# Altium project ESCV3.PrjPcb
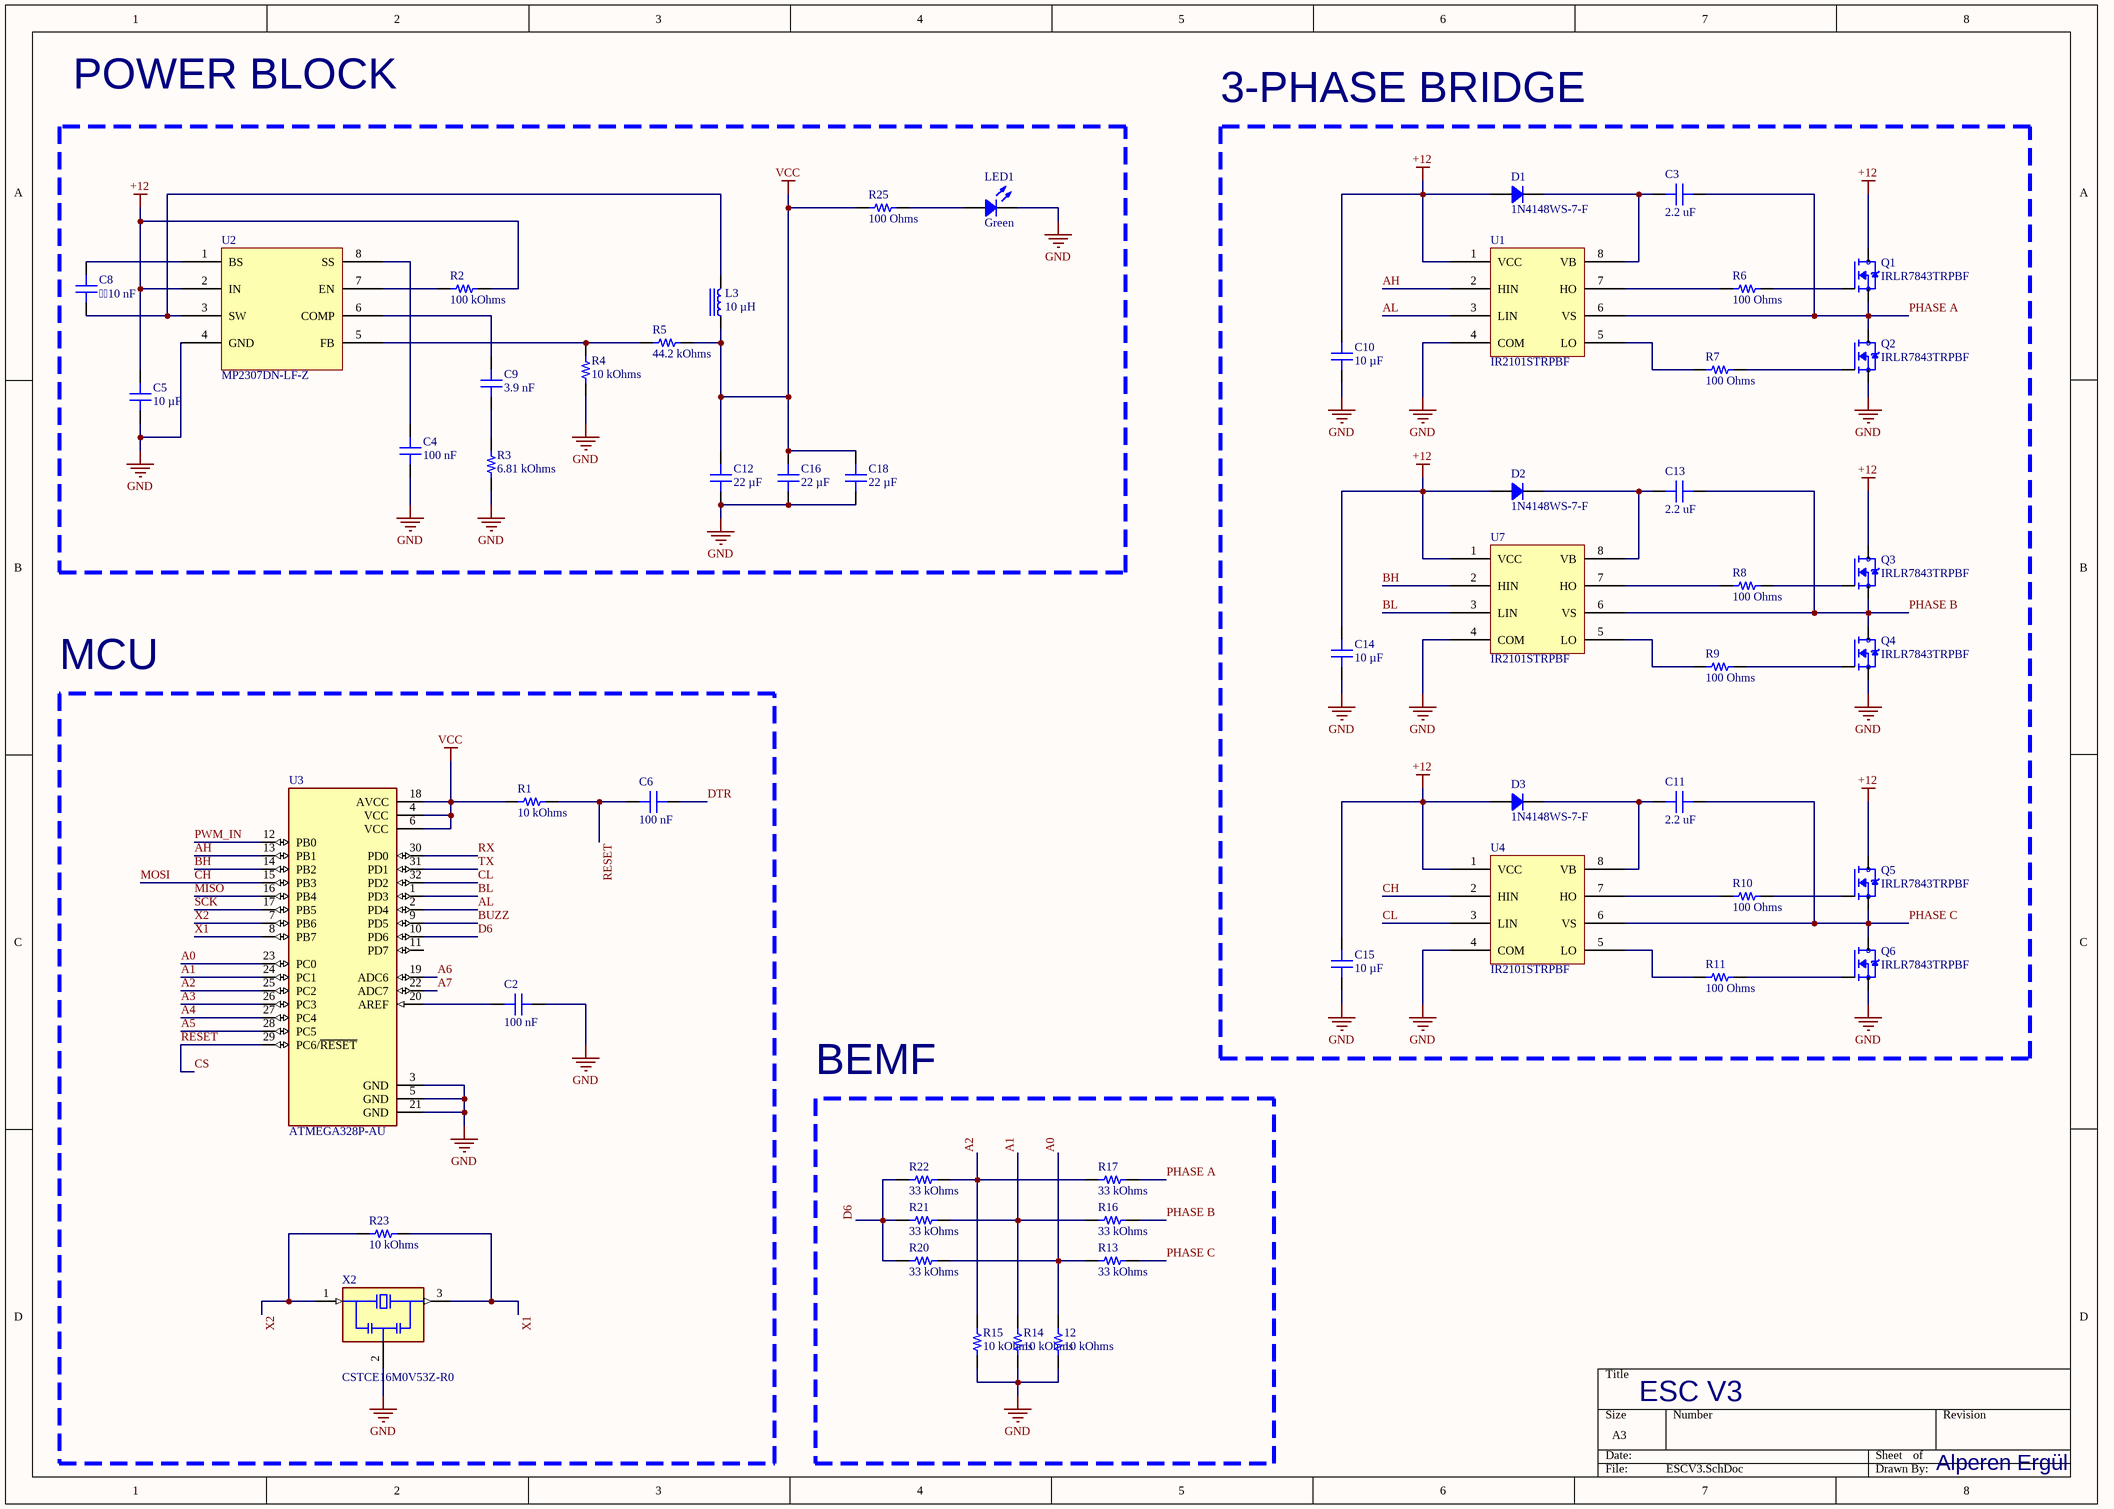
[diagram p0: ESCV3.SchDoc]
1 sheet, 54 parts. Net scope: global (net labels, ports and power ports of the same name join across sheets).
Board file: ESCV3.PcbDoc

## Sheet ESCV3.SchDoc
size A3; SheetNumber: 1; SheetTotal: 1

### Parts
12  10 kOhms  [RES 0603_1608]
C2  100 nF  [CAP 0603_1608]
C3  2.2 uF  [CAP 0603_1608]
C4  100 nF  [CAP 0603_1608]
C5  10 µF  [CAP 1206_3216 - 0.8MM]
C6  100 nF  [CAP 0603_1608]
C8  10 nF  [CAP 0603_1608]
C9  3.9 nF  [CAP 0603_1608]
C10  10 µF  [CAP 1206_3216 - 0.8MM]
C11  2.2 uF  [CAP 0603_1608]
C12  22 µF  [CAP 1206_3216 - 0.8MM]
C13  2.2 uF  [CAP 0603_1608]
C14  10 µF  [CAP 1206_3216 - 0.8MM]
C15  10 µF  [CAP 1206_3216 - 0.8MM]
C16  22 µF  [CAP 1206_3216 - 0.8MM]
C18  22 µF  [CAP 1206_3216 - 0.8MM]
D1  1N4148WS-7-F  [SOD323]
D2  1N4148WS-7-F  [SOD323]
D3  1N4148WS-7-F  [SOD323]
L3  10 µH  [BOURNS SRP5030T]
LED1  Green  [LED 0603_1608 GREEN]
Q1  IRLR7843TRPBF  [TO229P990X239-3_4N]
Q2  IRLR7843TRPBF  [TO229P990X239-3_4N]
Q3  IRLR7843TRPBF  [TO229P990X239-3_4N]
Q4  IRLR7843TRPBF  [TO229P990X239-3_4N]
Q5  IRLR7843TRPBF  [TO229P990X239-3_4N]
Q6  IRLR7843TRPBF  [TO229P990X239-3_4N]
R1  10 kOhms  [RES 0603_1608]
R2  100 kOhms  [RES 0603_1608]
R3  6.81 kOhms  [RES 0603_1608]
R4  10 kOhms  [RES 0603_1608]
R5  44.2 kOhms  [RES 0603_1608]
R6  100 Ohms  [RES 0603_1608]
R7  100 Ohms  [RES 0603_1608]
R8  100 Ohms  [RES 0603_1608]
R9  100 Ohms  [RES 0603_1608]
R10  100 Ohms  [RES 0603_1608]
R11  100 Ohms  [RES 0603_1608]
R13  33 kOhms  [RES 0603_1608]
R14  10 kOhms  [RES 0603_1608]
R15  10 kOhms  [RES 0603_1608]
R16  33 kOhms  [RES 0603_1608]
R17  33 kOhms  [RES 0603_1608]
R20  33 kOhms  [RES 0603_1608]
R21  33 kOhms  [RES 0603_1608]
R22  33 kOhms  [RES 0603_1608]
R23  10 kOhms  [RES 0603_1608]
R25  100 Ohms  [RES 0603_1608]
U1  IR2101STRPBF  [IR2101STRPBF]
U2  MP2307DN-LF-Z  [MP2307DN-LF-Z]
U3  ATMEGA328P-AU  [QFP80P900X900X120-32N]
U4  IR2101STRPBF  [IR2101STRPBF]
U7  IR2101STRPBF  [IR2101STRPBF]
X2  CSTCE16M0V53Z-R0  [OSC_CSTCE16M0V53Z-R0]

### Blocks framed on the sheet
3-PHASE BRIDGE: C3 C10 C11 C13-C15 D1-D3 Q1-Q6 R6-R11 U1 U4 U7
MCU: C2 C6 R1 R23 U3 X2
BEMF: 12 R13-R17 R20-R22

### Nets
+12: C5.2 C10.2 C14.2 C15.2 D1.1 D2.1 D3.1 Q1.4(D) Q3.4(D) Q5.4(D) R2.2 U1.1(VCC) U2.2(IN) U4.1(VCC) U7.1(VCC)
GND: 12.1 C2.2 C4.1 C5.1 C10.1 C12.1 C14.1 C15.1 C16.1 C18.1 LED1.2 Q2.3(S) Q4.3(S) Q6.3(S) R3.1 R4.1 R14.1 R15.1 U1.4(COM) U2.4(GND) U3.3(GND) U3.5(GND) U3.21(GND) U4.4(COM) U7.4(COM) X2.2(GND)
VCC: C12.2 C16.2 C18.2 L3.1 R1.1 R5.2 R25.1 U3.4(VCC) U3.6(VCC) U3.18(AVCC)
A0: 12.2 R13.1 R20.2 U3.23(PC0)
A1: R14.2 R16.1 R21.2 U3.24(PC1)
A2: R15.2 R17.1 R22.2 U3.25(PC2)
A3: U3.26(PC3)
A4: U3.27(PC4)
A5: U3.28(PC5)
A6: U3.19(ADC6)
A7: U3.22(ADC7)
AH: U1.2(HIN) U3.13(PB1)
AL: U1.3(LIN) U3.2(PD4)
BH: U3.14(PB2) U7.2(HIN)
BL: U3.1(PD3) U7.3(LIN)
BUZZ: U3.9(PD5)
CH: U3.15(PB3) U4.2(HIN)  [also labelled MOSI]
CL: U3.32(PD2) U4.3(LIN)
CS: C6.1 R1.2 U3.29(PC6/~{RESET})  [also labelled RESET]
D6: R20.1 R21.1 R22.1 U3.10(PD6)
DTR: C6.2
MISO: U3.16(PB4)
PHASE A: C3.2 Q1.3(S) Q2.4(D) R17.2 U1.6(VS)
PHASE B: C13.2 Q3.3(S) Q4.4(D) R16.2 U7.6(VS)
PHASE C: C11.2 Q5.3(S) Q6.4(D) R13.2 U4.6(VS)
PWM_IN: U3.12(PB0)
RX: U3.30(PD0)
SCK: U3.17(PB5)
TX: U3.31(PD1)
X1: R23.2 U3.8(PB7) X2.3(OUT)
X2: R23.1 U3.7(PB6) X2.1(IN)
NetC2_1: C2.1 U3.20(AREF)
NetC3_1: C3.1 D1.2 U1.8(VB)
NetC4_2: C4.2 U2.8(SS)
NetC8_1: C8.1 U2.1(BS)
NetC8_2: C8.2 L3.2 U2.3(SW)
NetC9_1: C9.1 R3.2
NetC9_2: C9.2 U2.6(COMP)
NetC11_1: C11.1 D3.2 U4.8(VB)
NetC13_1: C13.1 D2.2 U7.8(VB)
NetLED1_1: LED1.1 R25.2
NetQ1_1: Q1.1(G) R6.2
NetQ2_1: Q2.1(G) R7.2
NetQ3_1: Q3.1(G) R8.2
NetQ4_1: Q4.1(G) R9.2
NetQ5_1: Q5.1(G) R10.2
NetQ6_1: Q6.1(G) R11.2
NetR2_1: R2.1 U2.7(EN)
NetR4_2: R4.2 R5.1 U2.5(FB)
NetR6_1: R6.1 U1.7(HO)
NetR7_1: R7.1 U1.5(LO)
NetR8_1: R8.1 U7.7(HO)
NetR9_1: R9.1 U7.5(LO)
NetR10_1: R10.1 U4.7(HO)
NetR11_1: R11.1 U4.5(LO)

Not connected (* = marked no-connect by the designer): U3 11(PD7)

### Notes on the sheet
- POWER BLOCK
- ESC V3
- Alperen Ergül

### Library data of the parts
12 R1 R4 R14 R15 R23 = RNCS0603BKE10K0: RES 10K OHM 0.1% 1/16W 0603; Manufacturer: Stackpole Electronics Inc; Power (Watts): 0.063W, 1/16W; Temperature Coefficient: ±25ppm/°C; Part Number: RNCS0603BKE10K0; Value: 10 kOhms; ComponentLink1Description: Datasheet; ComponentLink1URL: https://www.seielect.com/catalog/sei-rncs_rnch.pdf; ComponentLink2Description: DigiKey Link; ComponentLink2URL: https://www.digikey.com/en/products/detail/stackpole-electronics-inc/RNCS0603BKE10K0/1708836; Composition: Thin Film; Device Package: 0603 (1608 Metric); Features: Anti-Corrosive, Automotive AEC-Q200, Moisture Resistant; Height - Seated (Max): 0.022" (0.55mm); LastUpdated: 9.02.2024 20:43:37; Lifecycle Status: Active; Minimum Order: 1; Number of Terminations: 2; Operating Temperature: -55°C ~ 155°C; Package / Case: 0603 (1608 Metric); Packaging: TapeAndReel; PartId: 4838; Part Status: Active; Price: 0.06; Ratings: AEC-Q200; Resistance: 10 kOhms; Series: RNCS; Size / Dimension: 0.061" L x 0.031" W (1.55mm x 0.80mm); Supplier 1: DigiKey; Supplier Part Number 1: RNCS0603BKE10K0CT-ND; Supplier Device Package: 0603; Tolerance: ±0.1%
C2-C4 C6 C8 C9 C11 C13 = CBR06C399BAGAC: CAP CER 3.9PF 250V C0G/NP0 0603; manufacturer: KEMET; Temperature Coefficient: C0G, NP0; Tolerance: ±0.1pF; Part Number: CBR06C399BAGAC; Applications: RF, Microwave, High Frequency; Capacitance: 3.9 pF; componentlink1description: Datasheet; componentlink1url: https://api.kemet.com/component-edge/download/datasheet/CBR06C399BAGAC.pdf; componentlink2description: DigiKey Link; componentlink2url: https://www.digikey.com/en/products/detail/kemet/CBR06C399BAGAC/3479707; Device Package: 0603 (1608 Metric); Features: High Q, Low Loss, Ultra Low ESR; lastupdated: 9.02.2024 20:10:06; Lifecycle Status: Active; Minimum Order: 1; Mounting Type: Surface Mount, MLCC; Operating Temperature: -55°C ~ 125°C; Package / Case: 0603 (1608 Metric); packaging: TapeAndReel; partid: 18061; Part Status: Active; price: 0.12; series: CBR-SMD RF C0G; Size / Dimension: 0.063" L x 0.031" W (1.60mm x 0.80mm); Supplier 1: DigiKey; Supplier Part Number 1: 399-8807-1-ND; Thickness (Max): 0.035" (0.90mm); Voltage - Rated: 250V
  C2 C4 C6: Value: 100 nF
  C3 C11 C13: Value: 2.2 uF
  C9: Value: 3.9 nF
C5 C10 C14 C15 = EMK316BJ106MD-T: CAP CER 10UF 16V X5R 1206; manufacturer: Taiyo Yuden; Tolerance: ±20%; Part Number: EMK316BJ106MD-T; Value: 10 µF; Applications: SMPS Filtering; Capacitance: 10 µF; componentlink1description: Datasheet; componentlink1url: http://www.yuden.co.jp/productdata/catalog/mlcc06_e.pdf; componentlink2description: DigiKey Link; componentlink2url: https://www.digikey.com/en/products/detail/taiyo-yuden/EMK316BJ106MD-T/6563474; Device Package: 1206 (3216 Metric); lastupdated: 4.06.2024 19:10:41; Lifecycle Status: Active; Minimum Order: 1; Mounting Type: Surface Mount, MLCC; Operating Temperature: -55°C ~ 85°C; Package / Case: 1206 (3216 Metric); packaging: TapeAndReel; partid: 18996; Part Status: Active; price: 0.04; series: M; Size / Dimension: 0.126" L x 0.063" W (3.20mm x 1.60mm); Supplier 1: DigiKey; Supplier Part Number 1: 587-4881-1-ND; Temperature Coefficient: X5R; Thickness (Max): 0.037" (0.95mm); Voltage - Rated: 16V
C12 C16 C18 = CL31A226MOCLNNC: CAP CER 22UF 16V X5R 1206; manufacturer: Samsung Electro-Mechanics; Tolerance: ±20%; Part Number: CL31A226MOCLNNC; Value: 22 µF; Applications: General Purpose; Capacitance: 22 µF; componentlink1description: Datasheet; componentlink1url: http://www.samsungsem.com/kr/support/product-search/mlcc/CL31A226MOCLNNC.jsp; componentlink2description: DigiKey Link; componentlink2url: https://www.digikey.com/en/products/detail/samsung-electro-mechanics/CL31A226MOCLNNC/3888386; Device Package: 1206 (3216 Metric); Features: Low Profile; lastupdated: 4.06.2024 19:10:40; Lifecycle Status: Active; Minimum Order: 1; Mounting Type: Surface Mount, MLCC; Operating Temperature: -55°C ~ 85°C; Package / Case: 1206 (3216 Metric); packaging: TapeAndReel; partid: 19106; Part Status: Active; price: 0.04; series: CL; Size / Dimension: 0.126" L x 0.063" W (3.20mm x 1.60mm); Supplier 1: DigiKey; Supplier Part Number 1: 1276-2728-1-ND; Temperature Coefficient: X5R; Thickness (Max): 0.037" (0.95mm); Voltage - Rated: 16V
D1-D3 = 1N4148WS-7-F: DIODE GEN PURP 75V 150MA SOD323; Manufacturer: Diodes Incorporated; Capacitance @ Vr, F: 2pF @ 0V, 1MHz; Current - Reverse Leakage @ Vr: 1 µA @ 75 V; Diode Type: Standard; Reverse Recovery Time (trr): 4 ns; Speed: Small Signal =< 200mA (Io), Any Speed; Voltage - Forward (Vf) (Max) @ If: 1.25 V @ 150 mA; Part Number: 1N4148WS-7-F; ComponentLink1Description: Datasheet; ComponentLink1URL: https://www.diodes.com/assets/Datasheets/ds30097.pdf; ComponentLink2Description: DigiKey Link; ComponentLink2URL: https://www.digikey.com/en/products/detail/diodes-incorporated/1N4148WS-7-F/815127; Current - Average Rectified (Io): 150mA; LastUpdated: 3.06.2024 20:20:13; Lifecycle Status: Active; Minimum Order: 1; Mounting Type: Surface Mount; Operating Temperature - Junction: -65°C ~ 150°C; Package / Case: SC-76, SOD-323; Packaging: TapeAndReel; PartId: 3076; Part Status: Active; Price: 0.02; Series: -; Supplier 1: DigiKey; Supplier Part Number 1: 1N4148WS-FDICT-ND; Supplier Device Package: SOD-323; Voltage - DC Reverse (Vr) (Max): 75 V
L3 = SRP5030T-100M: FIXED IND 10UH 2.75A 128MOHM SMD; Manufacturer: Bourns Inc.; Current - Saturation: 3.5A; DC Resistance (DCR): 128mOhm Max; Inductance Frequency - Test: 100 kHz; Material - Core: Iron Powder; Shielding: Shielded; Tolerance: ±20%; Type: Drum Core, Wirewound; Part Number: SRP5030T-100M; ComponentLink1Description: Datasheet; ComponentLink1URL: https://www.bourns.com/docs/Product-Datasheets/SRP5030T.pdf; ComponentLink2Description: DigiKey Link; ComponentLink2URL: https://www.digikey.com/en/products/detail/bourns-inc/SRP5030T-100M/3986087; Current Rating (Amps): 2.75 A; Device Package: Nonstandard; Height - Seated (Max): 0.118" (3.00mm); Inductance: 10 µH; LastUpdated: 3.06.2024 20:02:35; Lifecycle Status: Active; Minimum Order: 1; Mounting Type: Surface Mount; Operating Temperature: -40°C ~ 125°C; Package / Case: Nonstandard; Packaging: TapeAndReel; PartId: 9; Part Status: Active; Price: 0.59; Series: SRP5030T; Size / Dimension: 0.224" L x 0.205" W (5.70mm x 5.20mm); Supplier 1: DigiKey; Supplier Part Number 1: SRP5030T-100MCT-ND; Value: 10 µH
LED1 = LSM0603453V: LED GREEN CLEAR CHIP 0603 SMD; Manufacturer: Visual Communications Company - VCC; Configuration: Standard; Current - Test: 20mA; Lens Color: Colorless; Lens Size: 1.20mm x 0.80mm; Lens Style: Rectangle with Flat Top; Millicandela Rating: 63mcd; Viewing Angle: 120°; Voltage - Forward (Vf) (Typ): 2V; Wavelength - Dominant: 572nm; Wavelength - Peak: 571nm; Part Number: LSM0603453V; Color: Green; ComponentLink1Description: Datasheet; ComponentLink1URL: https://vcclite.com/wp-content/uploads/wpallimport/files/files/LSM0603453V.pdf; ComponentLink2Description: DigiKey Link; ComponentLink2URL: https://www.digikey.com/en/products/detail/visual-communications-company-vcc/LSM0603453V/9486724; Device Package: 0603 (1608 Metric); Height (Max): 0.65mm; LastUpdated: 3.06.2024 19:58:54; Lens Transparency: Clear; Lifecycle Status: Active; Minimum Order: 1; Mounting Type: Surface Mount; Package / Case: 0603 (1608 Metric); Packaging: TapeAndReel; PartId: 579; Part Status: Active; Price: 0.09; Series: LSM0603; Size / Dimension: 1.60mm L x 0.80mm W; Supplier 1: DigiKey; Supplier Part Number 1: LSM0603453VCT-ND; Supplier Device Package: Chip LED; Value: Green
Q1-Q6 = IRLR7843TRPBF: RoHS Compliant | Industry-leading quality | Low RDS(ON) at 4.5V VGS | Fully Characterized Avalanche Voltage and Current | Ultra-Low Gate Impedance | Logic Level; MF: Infineon Technologies; Value: *; Check_prices: https://www.snapeda.com/parts/IRLR7843TRPBF/Infineon+Technologies/view-part/?ref=eda; SnapEDA_Link: https://www.snapeda.com/parts/IRLR7843TRPBF/Infineon+Technologies/view-part/?ref=snap; Availability: In Stock; MP: IRLR7843TRPBF; Purchase-URL: https://pricing.snapeda.com/search/part/IRLR7843TRPBF/?ref=eda; Package: TO-252-3 Infineon; Price: None
R2 = RNCS0603BKE100K: RES 100K OHM 0.1% 1/16W 0603; Manufacturer: Stackpole Electronics Inc; Power (Watts): 0.063W, 1/16W; Temperature Coefficient: ±25ppm/°C; Part Number: RNCS0603BKE100K; Value: 100 kOhms; ComponentLink1Description: Datasheet; ComponentLink1URL: https://www.seielect.com/catalog/sei-rncs_rnch.pdf; ComponentLink2Description: DigiKey Link; ComponentLink2URL: https://www.digikey.com/en/products/detail/stackpole-electronics-inc/RNCS0603BKE100K/1708835; Composition: Thin Film; Device Package: 0603 (1608 Metric); Features: Anti-Corrosive, Automotive AEC-Q200, Moisture Resistant; Height - Seated (Max): 0.022" (0.55mm); LastUpdated: 9.02.2024 20:43:37; Lifecycle Status: Active; Minimum Order: 1; Number of Terminations: 2; Operating Temperature: -55°C ~ 155°C; Package / Case: 0603 (1608 Metric); Packaging: TapeAndReel; PartId: 4849; Part Status: Active; Price: 0.06; Ratings: AEC-Q200; Resistance: 100 kOhms; Series: RNCS; Size / Dimension: 0.061" L x 0.031" W (1.55mm x 0.80mm); Supplier 1: DigiKey; Supplier Part Number 1: RNCS0603BKE100KCT-ND; Supplier Device Package: 0603; Tolerance: ±0.1%
R3 = RQ73C1J6K81BTDF: RQ 0603 6K81 0.1% 10PPM 1K RL; Manufacturer: TE Connectivity Passive Product; Power (Watts): 0.15W; Temperature Coefficient: ±10ppm/°C; Part Number: RQ73C1J6K81BTDF; Value: 6.81 kOhms; ComponentLink1Description: Datasheet; ComponentLink1URL: https://www.te.com/commerce/DocumentDelivery/DDEController?Action=srchrtrv&DocNm=1773270-2&DocType=DS&DocLang=English; ComponentLink2Description: DigiKey Link; ComponentLink2URL: https://www.digikey.com/en/products/detail/te-connectivity-passive-product/RQ73C1J6K81BTDF/13965021; Composition: Thin Film; Device Package: 0603 (1608 Metric); Features: Anti-Sulfur, Automotive AEC-Q200, Moisture Resistant; Height - Seated (Max): 0.022" (0.55mm); LastUpdated: 9.02.2024 20:41:31; Lifecycle Status: Active; Minimum Order: 1; Number of Terminations: 2; Operating Temperature: -55°C ~ 155°C; Package / Case: 0603 (1608 Metric); Packaging: TapeAndReel; PartId: 63038; Part Status: Active; Price: 0.38; Ratings: AEC-Q200; Resistance: 6.81 kOhms; Series: RQ73; Size / Dimension: 0.061" L x 0.031" W (1.55mm x 0.80mm); Supplier 1: DigiKey; Supplier Part Number 1: 1712-RQ73C1J6K81BTDFCT-ND; Supplier Device Package: 0603; Tolerance: ±0.1%
R5 = ERJ-PB3B4422V: RES SMD 44.2K OHM 0.1% 1/5W 0603; Manufacturer: Panasonic Electronic Components; Power (Watts): 0.2W, 1/5W; Temperature Coefficient: ±50ppm/°C; Part Number: ERJ-PB3B4422V; Value: 44.2 kOhms; ComponentLink1Description: Datasheet; ComponentLink1URL: https://industrial.panasonic.com/cdbs/www-data/pdf/RDM0000/AOA0000C328.pdf; ComponentLink2Description: DigiKey Link; ComponentLink2URL: https://www.digikey.com/en/products/detail/panasonic-electronic-components/ERJ-PB3B4422V/6212942; Composition: Thick Film; Device Package: 0603 (1608 Metric); Features: Automotive AEC-Q200, Pulse Withstanding; Height - Seated (Max): 0.022" (0.55mm); LastUpdated: 9.02.2024 20:43:36; Lifecycle Status: Active; Minimum Order: 1; Number of Terminations: 2; Operating Temperature: -55°C ~ 155°C; Package / Case: 0603 (1608 Metric); Packaging: TapeAndReel; PartId: 4939; Part Status: Active; Price: 0.02; Ratings: AEC-Q200; Resistance: 44.2 kOhms; Series: ERJ-PB3; Size / Dimension: 0.063" L x 0.031" W (1.60mm x 0.80mm); Supplier 1: DigiKey; Supplier Part Number 1: P20159CT-ND; Supplier Device Package: 0603; Tolerance: ±0.1%
R6-R11 R25 = RNCS0603BKE100R: RES 100 OHM 0.1% 1/16W 0603; Manufacturer: Stackpole Electronics Inc; Power (Watts): 0.063W, 1/16W; Temperature Coefficient: ±25ppm/°C; Part Number: RNCS0603BKE100R; Value: 100 Ohms; ComponentLink1Description: Datasheet; ComponentLink1URL: https://www.seielect.com/catalog/sei-rncs_rnch.pdf; ComponentLink2Description: DigiKey Link; ComponentLink2URL: https://www.digikey.com/en/products/detail/stackpole-electronics-inc/RNCS0603BKE100R/1799988; Composition: Thin Film; Device Package: 0603 (1608 Metric); Features: Anti-Corrosive, Automotive AEC-Q200, Moisture Resistant; Height - Seated (Max): 0.022" (0.55mm); LastUpdated: 9.02.2024 20:43:37; Lifecycle Status: Active; Minimum Order: 1; Number of Terminations: 2; Operating Temperature: -55°C ~ 155°C; Package / Case: 0603 (1608 Metric); Packaging: TapeAndReel; PartId: 4839; Part Status: Active; Price: 0.06; Ratings: AEC-Q200; Resistance: 100 Ohms; Series: RNCS; Size / Dimension: 0.061" L x 0.031" W (1.55mm x 0.80mm); Supplier 1: DigiKey; Supplier Part Number 1: RNCS0603BKE100RCT-ND; Supplier Device Package: 0603; Tolerance: ±0.1%
R13 R16 R17 R20-R22 = CPF0603B33KE1: RES SMD 33K OHM 0.1% 1/16W 0603; Manufacturer: TE Connectivity Passive Product; Power (Watts): 0.063W, 1/16W; Temperature Coefficient: ±25ppm/°C; Part Number: CPF0603B33KE1; Value: 33 kOhms; ComponentLink1Description: Datasheet; ComponentLink1URL: https://www.te.com/commerce/DocumentDelivery/DDEController?Action=srchrtrv&DocNm=1773200&DocType=DS&DocLang=English; ComponentLink2Description: DigiKey Link; ComponentLink2URL: https://www.digikey.com/en/products/detail/te-connectivity-passive-product/CPF0603B33KE1/2381952; Composition: Thin Film; Device Package: 0603 (1608 Metric); Height - Seated (Max): 0.022" (0.55mm); LastUpdated: 9.02.2024 20:43:33; Lifecycle Status: Active; Minimum Order: 1; Number of Terminations: 2; Operating Temperature: -55°C ~ 155°C; Package / Case: 0603 (1608 Metric); Packaging: TapeAndReel; PartId: 5785; Part Status: Active; Price: 0.12; Resistance: 33 kOhms; Series: CPF, Neohm; Size / Dimension: 0.061" L x 0.031" W (1.55mm x 0.80mm); Supplier 1: DigiKey; Supplier Part Number 1: A103086CT-ND; Supplier Device Package: 0603; Tolerance: ±0.1%
U3 = ATMEGA328P-AU: AVR AVRÂ® ATmega Microcontroller IC 8-Bit 20MHz 32KB (16K x 16) FLASH 32-TQFP (7x7); MF: Microchip Technology; SnapEDA_Link: https://www.snapeda.com/parts/ATMEGA328P-AU/Microchip/view-part/?ref=snap; Package: TQFP-32 Microchip; Value: *; MP: ATMEGA328P-AU; Check_prices: https://www.snapeda.com/parts/ATMEGA328P-AU/Microchip/view-part/?ref=eda
X2 = CSTCE16M0V53Z-R0: 20MHz Ceramic Resonator Built in Capacitor 15pF +/- 0.2% -40C - 125C Surface Mount; MF: Murata; MP: CSTCE16M0V53Z-R0; Package: None; Price: None; Availability: Unavailable; Value: *